# EAGLE design ATtinyRemote (EAGLE 6.1)
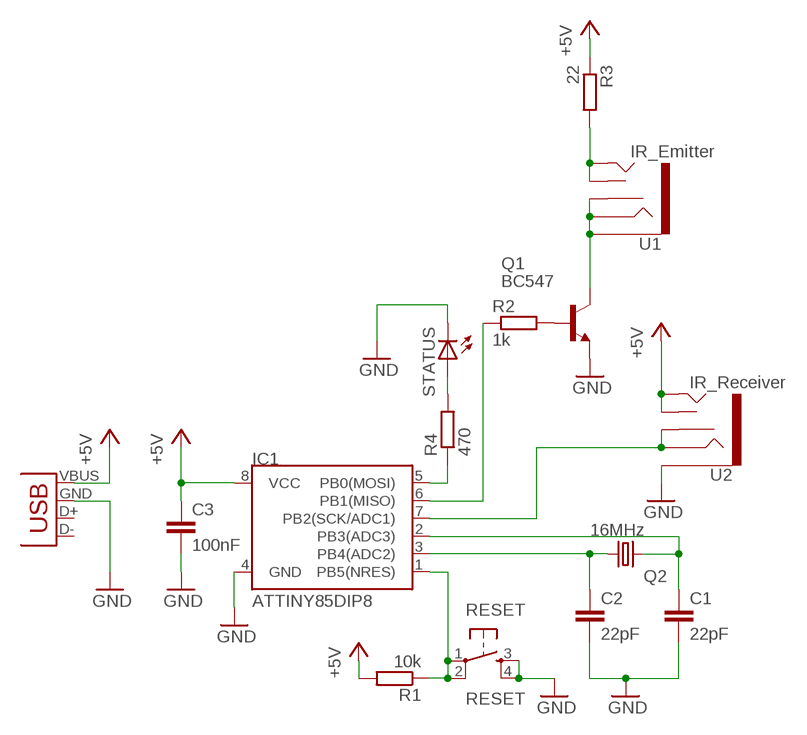
[diagram p0: schematic, sheet 1]

## Parts
C1  22pF  C-EU025-025X050  [C025-025X050]
C2  22pF  C-EU025-025X050  [C025-025X050]
C3  100nF  C-EU025-025X050  [C025-025X050]
IC1  ATTINY85DIP8  [DIP08]
Q1  BC547  [TO92]
Q2  16MHz  CRYSTALHC49S  [HC49/S]
R1  10k  R-EU_0207/10  [0207/10]
R2  1k  R-EU_0207/10  [0207/10]
R3  22  R-EU_0207/10  [0207/10]
R4  470  R-EU_0207/10  [0207/10]
RESET  RESET  TAC_SWITCHPTH  [TACTILE-PTH]
STATUS  LED3MM  [LED3MM]
U1  IR_Emitter  AUDIO-JACK2PTH  [AUDIO-JACK]
U2  IR_Receiver  AUDIO-JACK2PTH  [AUDIO-JACK]
X1  USB-A-H  [USB-A-H]

## Nets
+5V: C3.1 IC1.8(VCC) R1.2 R3.1 U2.TIP U2.TSH X1.VBUS(GND)
GND: C1.2 C2.2 C3.2 IC1.4(GND) Q1.1(E) RESET.3 RESET.4 STATUS.K(C) U2.SLEEVE X1.GND(VBUS)
N$1: C2.1 IC1.3(PB4(ADC2)) Q2.1
N$2: R3.2 U1.TIP U1.TSH
N$3: IC1.1(PB5(NRES)) R1.1 RESET.1 RESET.2
N$5: Q1.3(C) U1.RING U1.RSH U1.SLEEVE
N$6: IC1.7(PB2(SCK/ADC1)) U2.RING U2.RSH
N$7: Q1.2(B) R2.2
N$8: IC1.6(PB1(MISO)) R2.1
N$9: R4.2 STATUS.A
N$10: IC1.5(PB0(MOSI)) R4.1
N$11: C1.1 IC1.2(PB3(ADC3)) Q2.2
Unconnected: X1.D+(D-) X1.D-(D+)

## Library data of the parts
C1-C3 = rcl:C-EU: CAPACITOR, European symbol
IC1 = ATtiny85:ATTINY85: Atmel ATtiny85
Q1 = transistor-npn:BC547*: NPN Transistor
Q2 = crystal:CRYSTAL: CRYSTAL; OC_FARNELL: 1667008; OC_NEWARK: unknown
R1-R4 = resistor:R-EU_: RESISTOR, European symbol
RESET = SparkFun:TAC_SWITCH: Momentary Switch Button commonly used for reset or general input. Spark Fun Electronics SKU : COM-00097
STATUS = led:LED: LED OSRAM: - CHIPLED LG R971, LG N971, LY N971, LG Q971, LY Q971, LO R971, LY R971 LH N974, LH R974 LS Q976, LO Q976, LY Q976 LO Q996 - Hyper CHIPLED LW Q18S LB Q993, LB Q99A, LB R99A - SideLED LS A670, LO A670, LY A670, LG A670, LP A670 LB A673, LV A673, LT A673, LW A673 LH A674 LY A675 LS A676, LA A676, LO A676, LY A676, LW A676 LS A679, LY A679, LG A679 - Hyper Micro SIDELED® LS Y876, LA Y876, LO Y876, LY Y876 LT Y87S - SmartLED LW L88C, LW L88S LB L89C, LB L89S, LG L890 LS L89K, LO L89K, LY L89K LS L896, LA L896, LO L896, LY L896 - TOPLED LS T670, LO T670, LY T670, LG T670, LP T670 LSG T670, LSP T670, LSY T670, LOP T670, LYG T670 LG T671, LOG T671, LSG T671 LB T673, LV T673, LT T673, LW T673 LH T674 LS T676, LA T676, LO T676, LY T676, LB T676, LH T676, LSB T676, LW T676 LB T67C, LV T67C, LT T67C, LS T67K, LO T67K, LY T67K, LW E67C LS E67B, LA E67B, LO E67B, LY E67B, LB E67C, LV E67C, LT E67C LW T67C LS T679, LY T679, LG T679 LS T770, LO T770, LY T770, LG T770, LP T770 LB T773, LV T773, LT T773, LW T773 LH T774 LS E675, LA E675, LY E675, LS T675 LS T776, LA T776, LO T776, LY T776, LB T776 LHGB T686 LT T68C, LB T68C - Hyper Mini TOPLED® LB M676 - Mini TOPLED Santana® LG M470 LS M47K, LO M47K, LY M47K Source: http://www.osram.convergy.de LUXEON: - LUMILED® LXK2-PW12-R00, LXK2-PW12-S00, LXK2-PW14-U00, LXK2-PW14-V00 LXK2-PM12-R00, LXK2-PM12-S00, LXK2-PM14-U00 LXK2-PE12-Q00, LXK2-PE12-R00, LXK2-PE12-S00, LXK2-PE14-T00, LXK2-PE14-U00 LXK2-PB12-K00, LXK2-PB12-L00, LXK2-PB12-M00, LXK2-PB14-N00, LXK2-PB14-P00, LXK2-PB14-Q00 LXK2-PR12-L00, LXK2-PR12-M00, LXK2-PR14-Q00, LXK2-PR14-R00 LXK2-PD12-Q00, LXK2-PD12-R00, LXK2-PD12-S00 LXK2-PH12-R00, LXK2-PH12-S00 LXK2-PL12-P00, LXK2-PL12-Q00, LXK2-PL12-R00 Source: www.luxeon.com KINGBRIGHT: KA-3528ASYC Source: www.kingbright.com
U1 U2 = SparkFun:AUDIO-JACK2
X1 = SparkFun:USB: USB Connectors USB-B-PTH is fully proven SKU : PRT-00139 USB-miniB is fully proven SKU : PRT-00587 USB-A-PCB is untested. USB-A-H is throughly reviewed, but untested. Spark Fun Electronics SKU : PRT-00437 USB-B-SMT is throughly reviewed, but untested. Needs silkscreen touching up. USB-A-S has not been used/tested USB-MB-H has not been used/tested

## Board
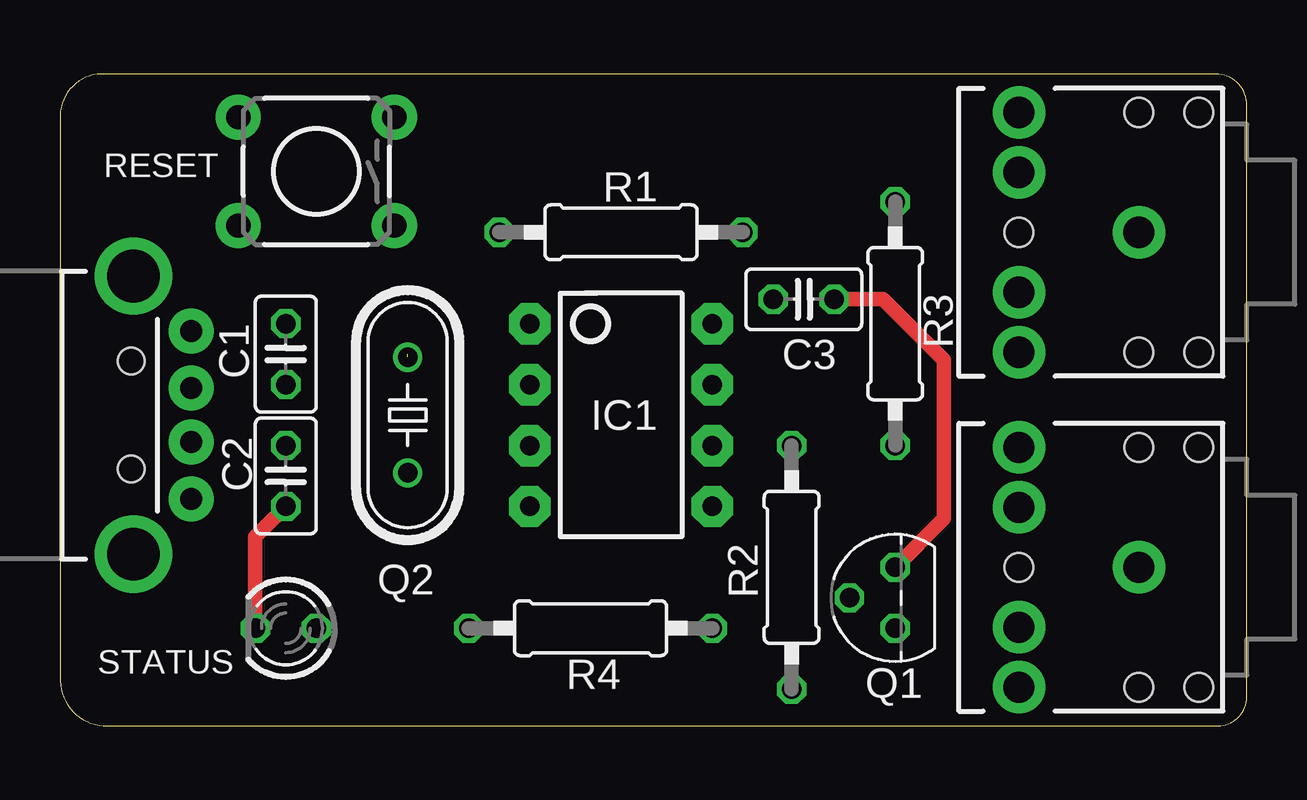
[diagram p1: board, top side]
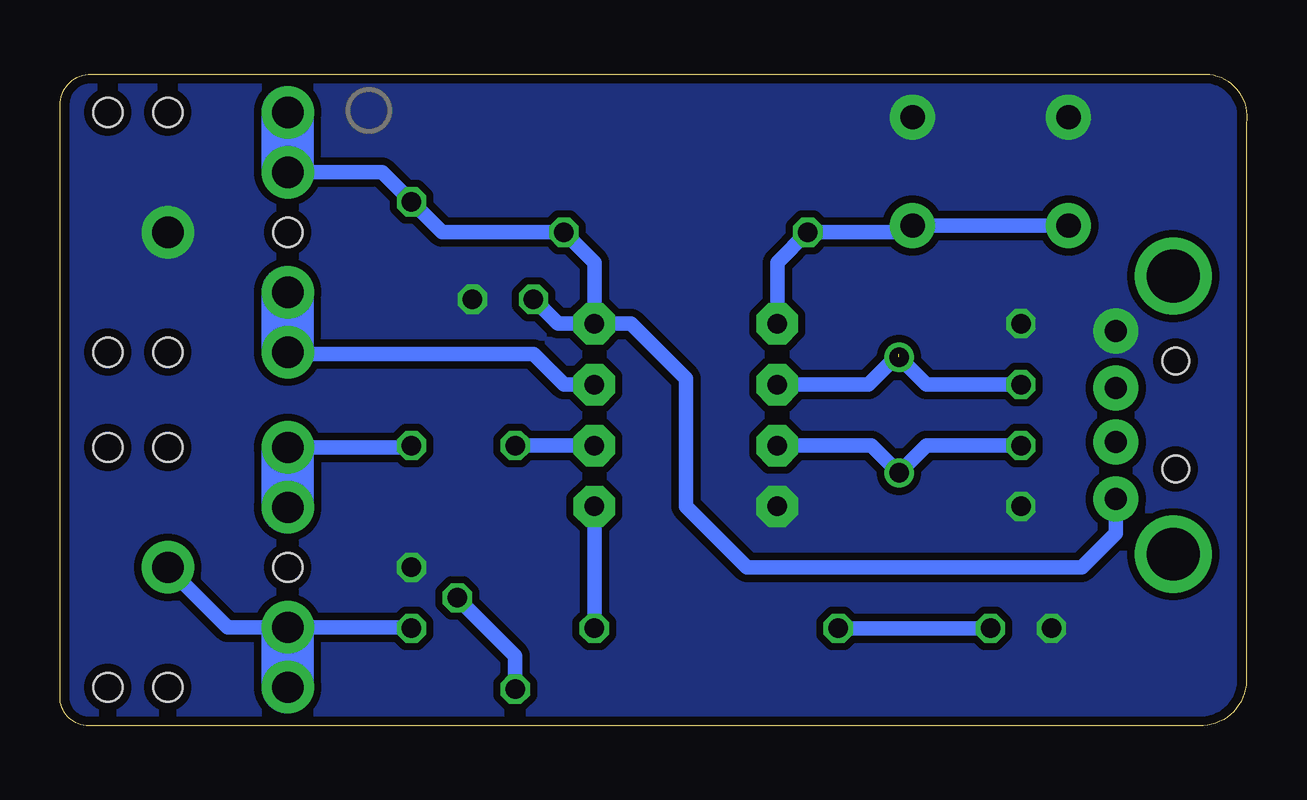
[diagram p2: board, bottom side, seen from below]

Size 49.47 x 27.17 mm. Coordinates in mm from the lower left corner, seen from the top.
Outline: 0.02,25.12 0.02,2.05 arc90 1.81,0 48.28,0 arc90 49.47,1.19 49.47,25.87 arc90 48.18,27.17 1.55,27.17 arc90 0.02,25.12
Copper layers (1*16): Top 0.0356mm / dielectric 1.5011mm / Bottom 0.0356mm
Design rules: minimum track width 6mil, minimum drill 13mil, track to track 6mil, track to pad 6mil, pad to pad 6mil, via to via 6mil, smd to smd 6mil, copper to edge 15mil, drill to drill 6mil, minimum pad ring 7mil, minimum via ring 7mil, stop-mask expansion 4mil, vias tented up to drill 0mil, thermal gap 10mil

### Footprints (pad centres in the part's own frame; a part is rotated, then mirrored left to right if it is on the bottom)
C025-025X050 = drill 0.813 octagon: 1 -1.27,0; 2 1.27,0
DIP08 = drill 0.813 pad 1.727 octagon: 1 -3.81,-3.81; 2 -1.27,-3.81; 3 1.27,-3.81; 4 3.81,-3.81; 5 3.81,3.81; 6 1.27,3.81; 7 -1.27,3.81; 8 -3.81,3.81
TO92 = drill 0.813 octagon: 1 1.27,0; 2 0,1.905; 3 -1.27,0
HC49/S = drill 0.813: 1 -2.413,0; 2 2.413,0
0207/10 = drill 0.813 octagon: 1 -5.08,0; 2 5.08,0
TACTILE-PTH = drill 1.016 pad 1.88: 1 -3.251,2.261; 2 3.251,2.261; 3 -3.251,-2.261; 4 3.251,-2.261
LED3MM = drill 0.813 octagon: A -1.27,0; K 1.27,0
AUDIO-JACK = drill 1.3 pad 2.184: RING 5,5; RSH 5,2.5; SLEEVE 0,0; TIP 5,-5; TSH 5,-2.5 | hole 1.2: 0,5; -2.5,5; -2.5,-5; 0,-5; 5,0
USB-A-H = drill 0.914 pad 1.88: D+ 2.4,1.127; D- 2.4,-1.127; GND 2.4,3.5; VBUS 2.4,-3.5 | drill 2.2: GND2 0,-5.8; GND3 0,5.8 | hole 1.1: -0.1,2.25; -0.1,-2.25

### Placement (x,y rotation side)
C1  9.41,15.49 90 top
C2  9.41,10.41 270 top
C3  31,17.78 0 top
IC1  23.38,12.95 270 top
Q1  34.81,5.33 90 top
Q2  14.49,12.95 90 top
R1  23.38,20.57 0 top
R2  30.5,6.6 270 top
R3  34.81,16.76 270 top
R4  22.11,4.06 180 top
RESET  10.68,23.11 180 top
STATUS  9.41,4.06 180 top
U1  44.97,6.6 180 top
U2  44.97,20.57 180 top
X1  3.06,12.95 0 top

### Tracks (layer width: path | path; a pad name or v marks a point on that pad's centre or on a via)
+5V
  Bottom 0.61: X1.VBUS 5.46,8.01 6.87,6.6 20.84,6.6 23.38,9.14 23.38,14.48 25.67,16.76 IC1.8 | U2.TSH 36.04,23.07 R3.1 33.54,20.57 R1.2 27.19,19.3 IC1.8 | 27.19,16.51 IC1.8 | C3.1 28.72,16.76 IC1.8
  Bottom 2.184: U2.TSH U2.TIP
GND
  Top 0.61: C2.2 8.14,7.87 STATUS.K | C3.2 34.31,17.78 36.85,15.24 36.85,8.64 Q1.1
  pour Bottom (isolate 0.305, no thermals): 46.99,-1.02 -0.22,-1.02 arc-90 -2.02,0.78 -2.02,26.4 arc-90 -0.22,28.19 49.53,28.19 arc-90 51.32,25.13 51.32,3.32 arc-90
N$1
  Bottom 0.61: C2.1 13.35,11.68 Q2.1 15.64,11.68 IC1.3
N$2
  Bottom 0.61: U1.TIP 34.89,11.6 R3.2
  Bottom 2.184: U1.TIP U1.TSH
N$3
  Bottom 0.61: IC1.1 19.57,19.3 R1.1 14.22,20.57 RESET.1 RESET.2
N$5
  Bottom 0.61: U1.SLEEVE 42.47,4.1 U1.RSH 34.85,4.1 Q1.3
  Bottom 2.184: U1.RING U1.RSH
N$6
  Bottom 0.61: IC1.7 28.46,14.22 29.73,15.49 39.89,15.49 U2.RING
  Bottom 2.184: U2.RING U2.RSH
N$7
  Bottom 0.61: R2.2 30.5,2.92 Q1.2
N$8
  Bottom 0.61: IC1.6 R2.1
N$9
  Bottom 0.61: STATUS.A R4.2
N$10
  Bottom 0.61: R4.1 IC1.5
N$11  (1 unrouted)
  Bottom 0.61: C1.1 13.35,14.22 Q2.2 | IC1.2 15.76,14.22 14.49,15.49

### Text on the board
Measures: mm | mm
tDocu: ATtinyRemote
bDocu: TKJ Electronics 2012 | C | ATtinyRemote V1.0 | Receiver | Emitter